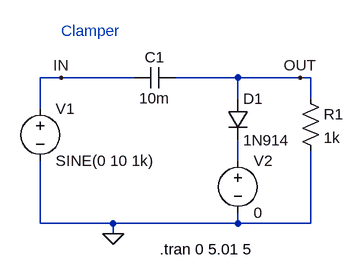
[diagram p0: schematic Clamper with diode.asc]
Clamper with diode.asc, the LTspice schematic file:
Version 4
SHEET 1 880 680
WIRE -160 80 -192 80
WIRE -48 80 -160 80
WIRE 112 80 16 80
WIRE 208 80 112 80
WIRE 224 80 208 80
WIRE 112 112 112 80
WIRE 224 112 224 80
WIRE -192 128 -192 80
WIRE 112 208 112 176
WIRE -192 304 -192 208
WIRE -80 304 -192 304
WIRE 112 304 112 288
WIRE 112 304 -80 304
WIRE 224 304 224 192
WIRE 224 304 112 304
WIRE -80 320 -80 304
FLAG -80 320 0
FLAG -160 80 IN
FLAG 208 80 OUT
SYMBOL diode 96 112 R0
SYMATTR InstName D1
SYMATTR Value 1N914
SYMBOL res 208 96 R0
SYMATTR InstName R1
SYMATTR Value 1k
SYMBOL cap -48 96 R270
WINDOW 0 32 32 VTop 2
WINDOW 3 0 32 VBottom 2
SYMATTR InstName C1
SYMATTR Value 10m
SYMATTR SpiceLine Irms=.001
SYMBOL voltage -192 112 R0
WINDOW 123 0 0 Left 0
WINDOW 39 24 124 Left 2
SYMATTR InstName V1
SYMATTR Value SINE(0 10 1k)
SYMBOL voltage 112 192 R0
WINDOW 123 0 0 Left 0
WINDOW 39 0 0 Left 0
SYMATTR InstName V2
SYMATTR Value 0
TEXT -160 8 Left 2 ;Clamper
TEXT -8 344 Left 2 !.tran 0 5.01 5

The netlist it stands for:
* Clamper with diode.asc
D1 OUT N001 1N914
R1 OUT 0 1k
C1 IN OUT 10m Irms=.001
V1 IN 0 SINE(0 10 1k)
V2 N001 0 0
.model D D
.lib standard.dio
* Clamper
.tran 0 5.01 5
.backanno
.end

* Results of the author's LTspice run, read from the files saved beside the schematic
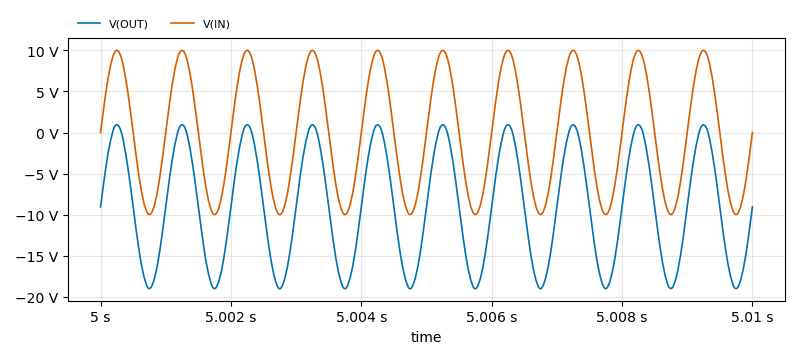
[diagram p1: Transient Analysis of Clamper with diode.asc, plotted from the saved traces]
* Transient Analysis, 1 run:
*   V(OUT): min -19.03 V, max 939.9 mV, average -9.034 V, rms 11.44 V, last -9.051 V
*   V(IN): min -10 V, max 10 V, average 4.183 mV, rms 7.085 V, last 0 V